# Altium schematic sheet 红外数字加模拟接收机.SchDoc
size A4
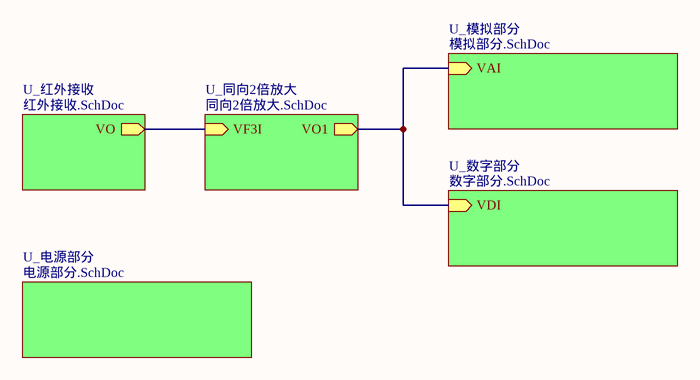
[diagram p0: 红外数字加模拟接收机.SchDoc]

## Sub-sheets
U_同向2倍放大 = 同向2倍放大.SchDoc: VO1 (out), VF3I (in)
U_数字部分 = 数字部分.SchDoc: VDI (in)
U_模拟部分 = 模拟部分.SchDoc: VAI (in)
U_电源部分 = 电源部分.SchDoc: no entries
U_红外接收 = 红外接收.SchDoc: VO (out)

## Nets
(unnamed): sheet U_模拟部分/VAI, sheet U_数字部分/VDI, sheet U_同向2倍放大/VO1
(unnamed): sheet U_红外接收/VO, sheet U_同向2倍放大/VF3I

## Notes on the sheet
- 标题
- 日期
- 红外数字模拟接收一体机
- 2015 5 29
- 作者
- 模电组
- 单位
- 电子技术协会